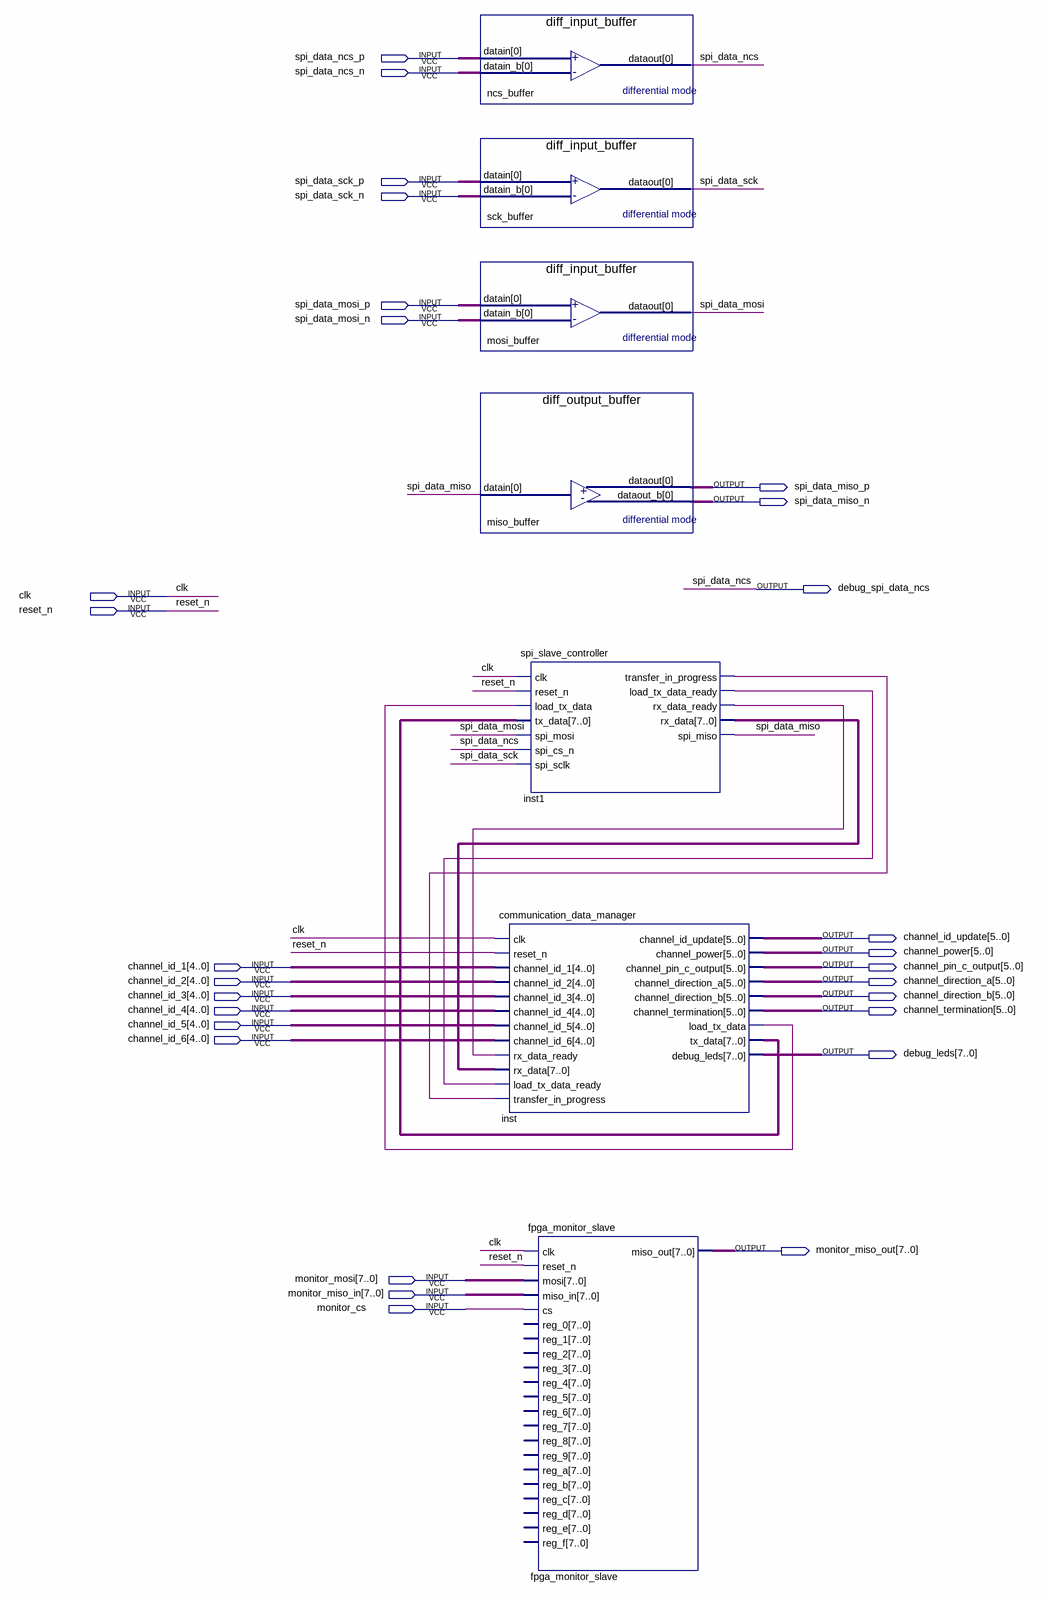
[diagram p0: schematic sheet]
// Quartus schematic communication_controller.bdf as structural Verilog: 7 symbols, 28 pins
module communication_controller (
  input  spi_data_ncs_p,
  input  spi_data_ncs_n,
  input  spi_data_sck_p,
  input  spi_data_sck_n,
  input  spi_data_mosi_p,
  input  spi_data_mosi_n,
  input  clk,
  input  reset_n,
  input  [4:0] channel_id_1,
  input  [4:0] channel_id_2,
  input  [4:0] channel_id_3,
  input  [4:0] channel_id_4,
  input  [4:0] channel_id_5,
  input  [4:0] channel_id_6,
  input  [7:0] monitor_mosi,
  input  [7:0] monitor_miso_in,
  input  monitor_cs,
  output spi_data_miso_p,
  output spi_data_miso_n,
  output debug_spi_data_ncs,
  output [5:0] channel_id_update,
  output [5:0] channel_power,
  output [5:0] channel_pin_c_output,
  output [5:0] channel_direction_a,
  output [5:0] channel_direction_b,
  output [5:0] channel_termination,
  output [7:0] debug_leds,
  output [7:0] monitor_miso_out
);

  wire inst1_load_tx_data_ready, inst1_rx_data_ready, inst1_transfer_in_progress, inst_load_tx_data,
       spi_data_miso, spi_data_mosi, spi_data_sck;
  wire [7:0] inst1_rx_data, inst_tx_data;

  diff_input_buffer ncs_buffer (.datain(spi_data_ncs_p), .datain_b(spi_data_ncs_n), .dataout(debug_spi_data_ncs));
  diff_input_buffer sck_buffer (.datain(spi_data_sck_p), .datain_b(spi_data_sck_n), .dataout(spi_data_sck));
  diff_input_buffer mosi_buffer (.datain(spi_data_mosi_p), .datain_b(spi_data_mosi_n), .dataout(spi_data_mosi));
  diff_output_buffer miso_buffer (.datain(spi_data_miso), .dataout(spi_data_miso_p), .dataout_b(spi_data_miso_n));
  communication_data_manager inst (
    .clk(clk), .reset_n(reset_n), .channel_id_1(channel_id_1), .channel_id_2(channel_id_2),
    .channel_id_3(channel_id_3), .channel_id_4(channel_id_4), .channel_id_5(channel_id_5),
    .channel_id_6(channel_id_6), .rx_data_ready(inst1_rx_data_ready), .rx_data(inst1_rx_data),
    .load_tx_data_ready(inst1_load_tx_data_ready), .transfer_in_progress(inst1_transfer_in_progress),
    .channel_id_update(channel_id_update), .channel_power(channel_power),
    .channel_pin_c_output(channel_pin_c_output), .channel_direction_a(channel_direction_a),
    .channel_direction_b(channel_direction_b), .channel_termination(channel_termination),
    .load_tx_data(inst_load_tx_data), .tx_data(inst_tx_data), .debug_leds(debug_leds));
  spi_slave_controller inst1 (
    .clk(clk), .reset_n(reset_n), .load_tx_data(inst_load_tx_data), .tx_data(inst_tx_data),
    .spi_mosi(spi_data_mosi), .spi_cs_n(debug_spi_data_ncs), .spi_sclk(spi_data_sck),
    .transfer_in_progress(inst1_transfer_in_progress), .load_tx_data_ready(inst1_load_tx_data_ready),
    .rx_data_ready(inst1_rx_data_ready), .rx_data(inst1_rx_data), .spi_miso(spi_data_miso));
  fpga_monitor_slave fpga_monitor_slave (
    .clk(clk), .reset_n(reset_n), .mosi(monitor_mosi), .miso_in(monitor_miso_in), .cs(monitor_cs),
    .miso_out(monitor_miso_out));  // open: reg_0, reg_1, reg_2, reg_3, reg_4, reg_5, reg_6, reg_7, reg_8, reg_9, reg_a, reg_b, reg_c, reg_d, reg_e, reg_f

  // Other names for the same wires on the sheet: spi_data_ncs = debug_spi_data_ncs
endmodule
